# EAGLE design icy-gecko (EAGLE 9.5.1)
COMPANY: RST; CREVISION: 1.0; DESIGNER: Rafael Silva; LICENSE: GNU General Public License v3.0; LINK: https://github.com/gimbas

## Sheet 1 of 4: MCU
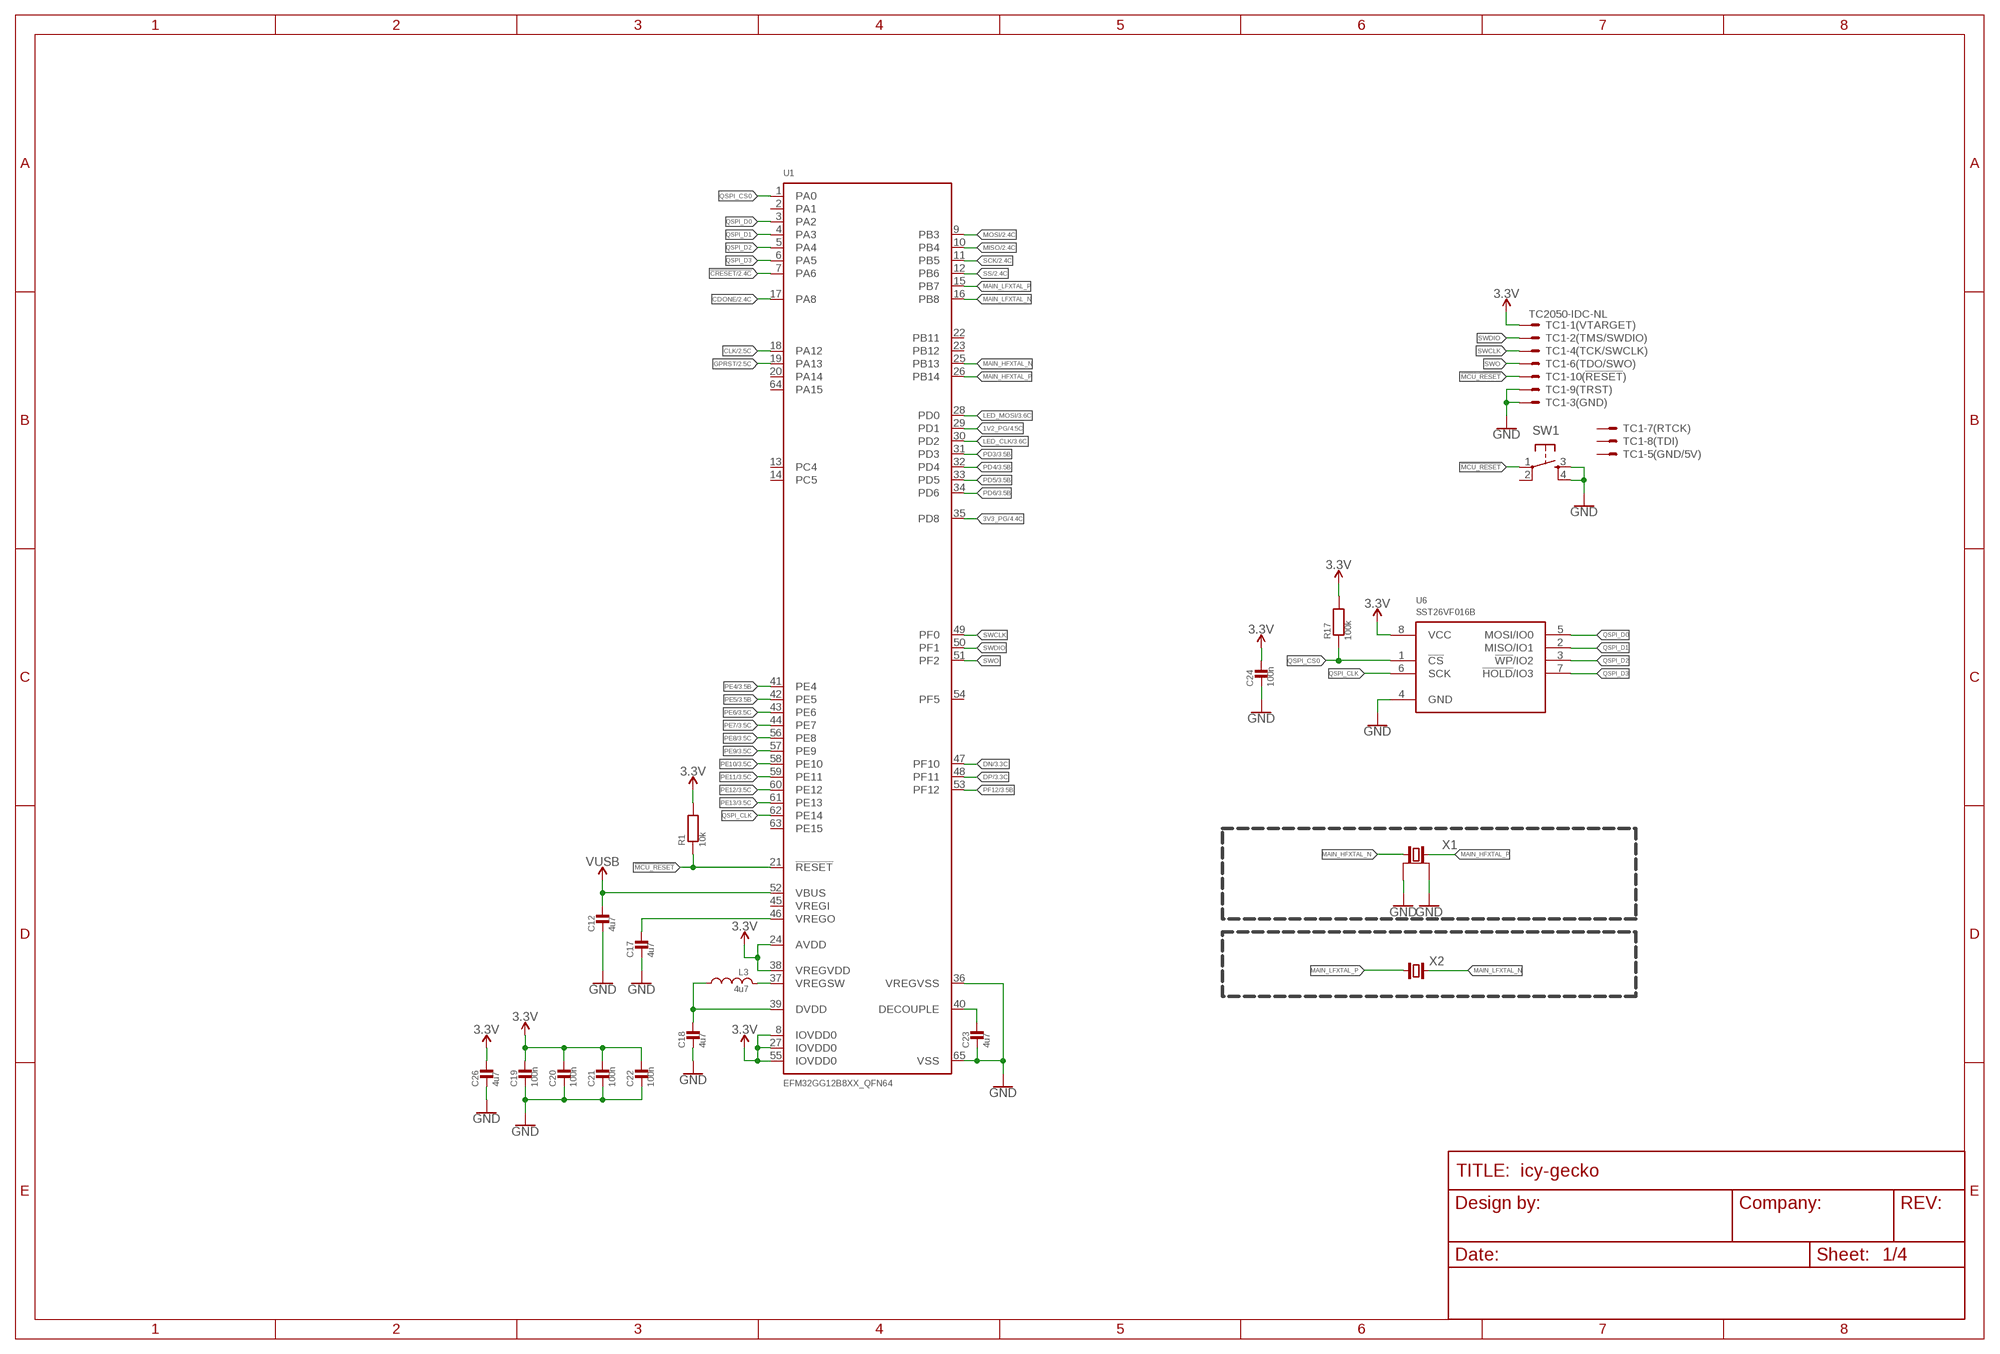
[diagram p0: schematic, sheet 1]

### Parts
C12  4u7  MLCC0603  [0603_WAVE]
C17  4u7  MLCC0603  [0603_WAVE]
C18  4u7  MLCC0603  [0603_WAVE]
C19  100n  MLCC0603  [0603_WAVE]
C20  100n  MLCC0603  [0603_WAVE]
C21  100n  MLCC0603  [0603_WAVE]
C22  100n  MLCC0603  [0603_WAVE]
C23  4u7  MLCC0603  [0603_WAVE]
C24  100n  MLCC0603  [0603_WAVE]
C26  4u7  MLCC0603  [0603_WAVE]
L3  4u7  INDUCTOR_NC_0806  [_0806]
R1  10k  RESISTOR0603  [0603_WAVE]
R17  100k  RESISTOR0603  [0603_WAVE]
SW1  PUSH_BUTTON  [PUSH_BUTTON]
TC1  TC2050-IDC-NL  [TC2050-IDC-NL]
U1  EFM32GG12B8XX_QFN64  [QFN64]
U6  SST26VF016B  [WSOIC8]
X1  CRYSTAL_4P  [4-SMD-3225]
X2  CRYSTAL2-SMD-3215  [2-SMD-3215]

### Nets
1V2_PG: U1.29(PD1) ; also sheet 4
3.3V: C19.P$1 C20.P$1 C21.P$1 C22.P$1 C24.P$1 C26.P$1 R1.P$2 R17.P$2 TC1.1 U1.8(IOVDD0) U1.24(AVDD) U1.27(IOVDD0) U1.38(VREGVDD) U1.55(IOVDD0) U6.8(VCC) ; also sheet 2,3,4
3V3_PG: U1.35(PD8) ; also sheet 4
!CRESET: U1.7(PA6) ; also sheet 2
!MCU_RESET: R1.P$1 SW1.1 TC1.10 U1.21(!RESET)
CDONE: U1.17(PA8) ; also sheet 2
CLK: U1.18(PA12) ; also sheet 2
DN: U1.47(PF10) ; also sheet 3
DP: U1.48(PF11) ; also sheet 3
GND: C12.P$2 C17.P$2 C18.P$2 C19.P$2 C20.P$2 C21.P$2 C22.P$2 C23.P$2 C24.P$2 C26.P$2 SW1.3 SW1.4 TC1.3 TC1.9 U1.36(VREGVSS) U1.65(VSS) U6.4(GND) X1.2(GND) X1.4(GND) ; also sheet 2,3,4
GPRST: U1.19(PA13) ; also sheet 2
LED_CLK: U1.30(PD2) ; also sheet 3
LED_MOSI: U1.28(PD0) ; also sheet 3
MAIN_HFXTAL_N: U1.25(PB13) X1.1
MAIN_HFXTAL_P: U1.26(PB14) X1.3
MAIN_LFXTAL_N: U1.16(PB8) X2.2
MAIN_LFXTAL_P: U1.15(PB7) X2.1
MISO: U1.10(PB4) ; also sheet 2
MOSI: U1.9(PB3) ; also sheet 2
N$39: C17.P$1 U1.46(VREGO)
N$43: L3.1 U1.37(VREGSW)
N$45: C23.P$1 U1.40(DECOUPLE)
N$48: C18.P$1 L3.2 U1.39(DVDD)
PD3: U1.31(PD3) ; also sheet 3
PD4: U1.32(PD4) ; also sheet 3
PD5: U1.33(PD5) ; also sheet 3
PD6: U1.34(PD6) ; also sheet 3
PE4: U1.41(PE4) ; also sheet 3
PE5: U1.42(PE5) ; also sheet 3
PE6: U1.43(PE6) ; also sheet 3
PE7: U1.44(PE7) ; also sheet 3
PE8: U1.56(PE8) ; also sheet 3
PE9: U1.57(PE9) ; also sheet 3
PE10: U1.58(PE10) ; also sheet 3
PE11: U1.59(PE11) ; also sheet 3
PE12: U1.60(PE12) ; also sheet 3
PE13: U1.61(PE13) ; also sheet 3
PF12: U1.53(PF12) ; also sheet 3
QSPI_CLK: U1.62(PE14) U6.6(SCK)
QSPI_CS0: R17.P$1 U1.1(PA0) U6.1(!CS!)
QSPI_D0: U1.3(PA2) U6.5(MOSI/IO0)
QSPI_D1: U1.4(PA3) U6.2(MISO/IO1)
QSPI_D2: U1.5(PA4) U6.3(!WP!/IO2)
QSPI_D3: U1.6(PA5) U6.7(!HOLD!/IO3)
SCK: U1.11(PB5) ; also sheet 2
SS: U1.12(PB6) ; also sheet 2
SWCLK: TC1.4 U1.49(PF0)
SWDIO: TC1.2 U1.50(PF1)
SWO: TC1.6 U1.51(PF2)
VUSB: C12.P$1 U1.52(VBUS) ; also sheet 3,4
Unconnected: SW1.2 TC1.5 TC1.7 TC1.8 U1.2(PA1) U1.13(PC4) U1.14(PC5) U1.20(PA14) U1.22(PB11) U1.23(PB12) U1.45(VREGI) U1.54(PF5) U1.63(PE15) U1.64(PA15)

## Sheet 2 of 4: FPGA
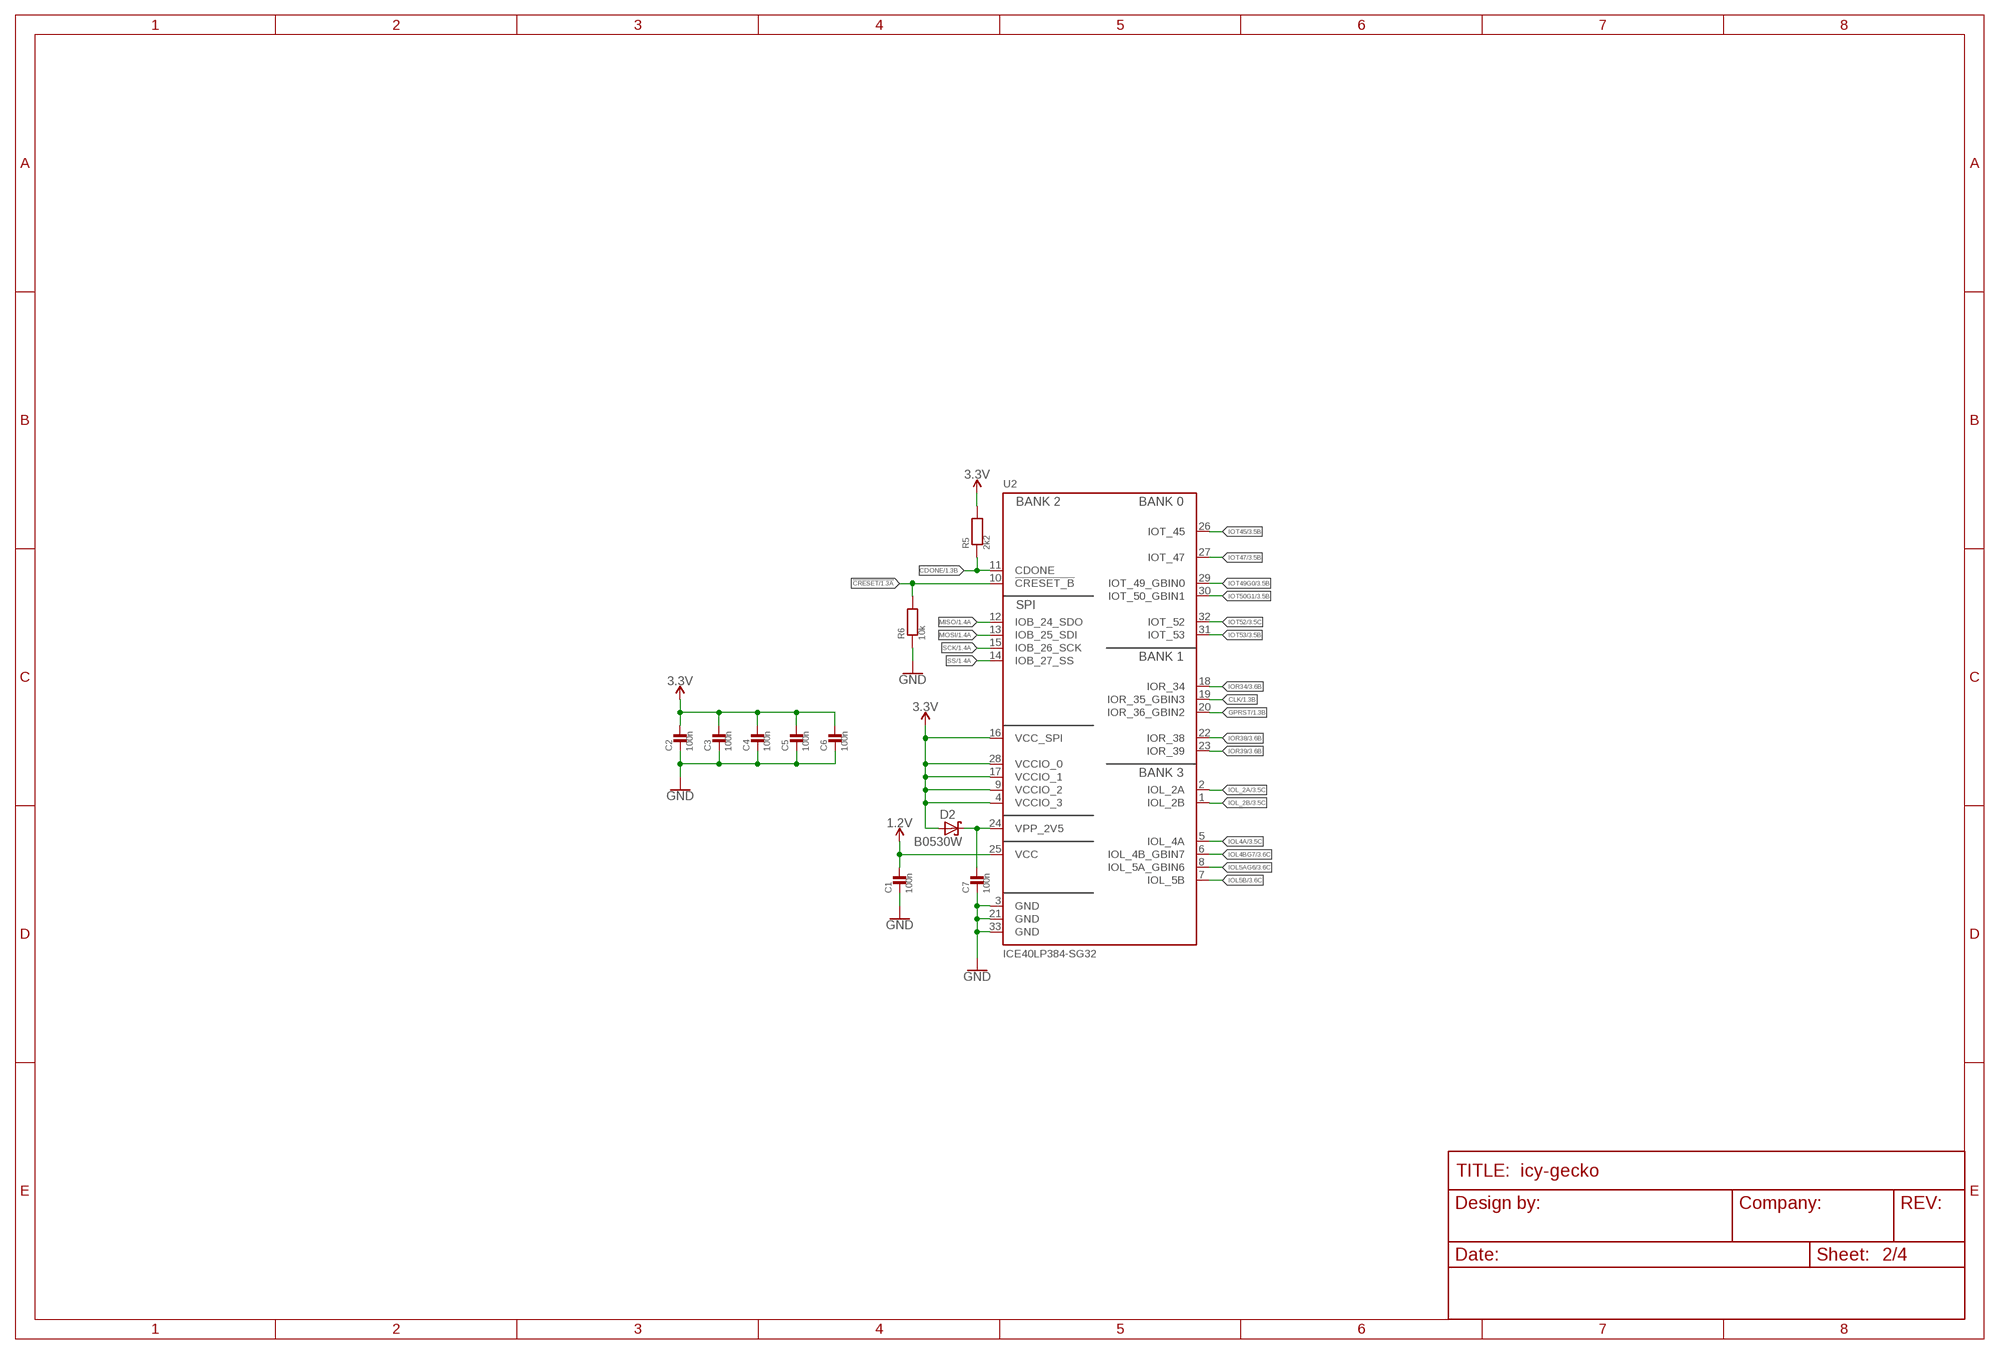
[diagram p1: schematic, sheet 2]

### Parts
C1  100n  MLCC0603  [0603_WAVE]
C2  100n  MLCC0603  [0603_WAVE]
C3  100n  MLCC0603  [0603_WAVE]
C4  100n  MLCC0603  [0603_WAVE]
C5  100n  MLCC0603  [0603_WAVE]
C6  100n  MLCC0603  [0603_WAVE]
C7  100n  MLCC0603  [0603_WAVE]
D2  B0530W  [SOD-123]
R5  2k2  RESISTOR0603  [0603_WAVE]
R6  10k  RESISTOR0603  [0603_WAVE]
U2  ICE40LP384-SG32  [QFN32]

### Nets
1.2V: C1.P$1 U2.25(VCC) ; also sheet 3,4
3.3V: C2.P$1 C3.P$1 C4.P$1 C5.P$1 C6.P$1 D2.A R5.P$2 U2.4(VCCIO_3) U2.9(VCCIO_2) U2.16(VCC_SPI) U2.17(VCCIO_1) U2.28(VCCIO_0) ; also sheet 1,3,4
!CRESET: R6.P$2 U2.10(!CRESET_B) ; also sheet 1
CDONE: R5.P$1 U2.11(CDONE) ; also sheet 1
CLK: U2.19(IOR_35_GBIN3) ; also sheet 1
GND: C1.P$2 C2.P$2 C3.P$2 C4.P$2 C5.P$2 C6.P$2 C7.P$2 R6.P$1 U2.3(GND) U2.21(GND) U2.33(GND) ; also sheet 1,3,4
GPRST: U2.20(IOR_36_GBIN2) ; also sheet 1
IOL4A: U2.5(IOL_4A) ; also sheet 3
IOL4BG7: U2.6(IOL_4B_GBIN7) ; also sheet 3
IOL5AG6: U2.8(IOL_5A_GBIN6) ; also sheet 3
IOL5B: U2.7(IOL_5B) ; also sheet 3
IOL_2A: U2.2(IOL_2A) ; also sheet 3
IOL_2B: U2.1(IOL_2B) ; also sheet 3
IOR34: U2.18(IOR_34) ; also sheet 3
IOR38: U2.22(IOR_38) ; also sheet 3
IOR39: U2.23(IOR_39) ; also sheet 3
IOT45: U2.26(IOT_45) ; also sheet 3
IOT47: U2.27(IOT_47) ; also sheet 3
IOT49G0: U2.29(IOT_49_GBIN0) ; also sheet 3
IOT50G1: U2.30(IOT_50_GBIN1) ; also sheet 3
IOT52: U2.32(IOT_52) ; also sheet 3
IOT53: U2.31(IOT_53) ; also sheet 3
MISO: U2.12(IOB_24_SDO) ; also sheet 1
MOSI: U2.13(IOB_25_SDI) ; also sheet 1
N$1: C7.P$1 D2.C U2.24(VPP_2V5)
SCK: U2.15(IOB_26_SCK) ; also sheet 1
SS: U2.14(IOB_27_SS) ; also sheet 1

## Sheet 3 of 4: IO
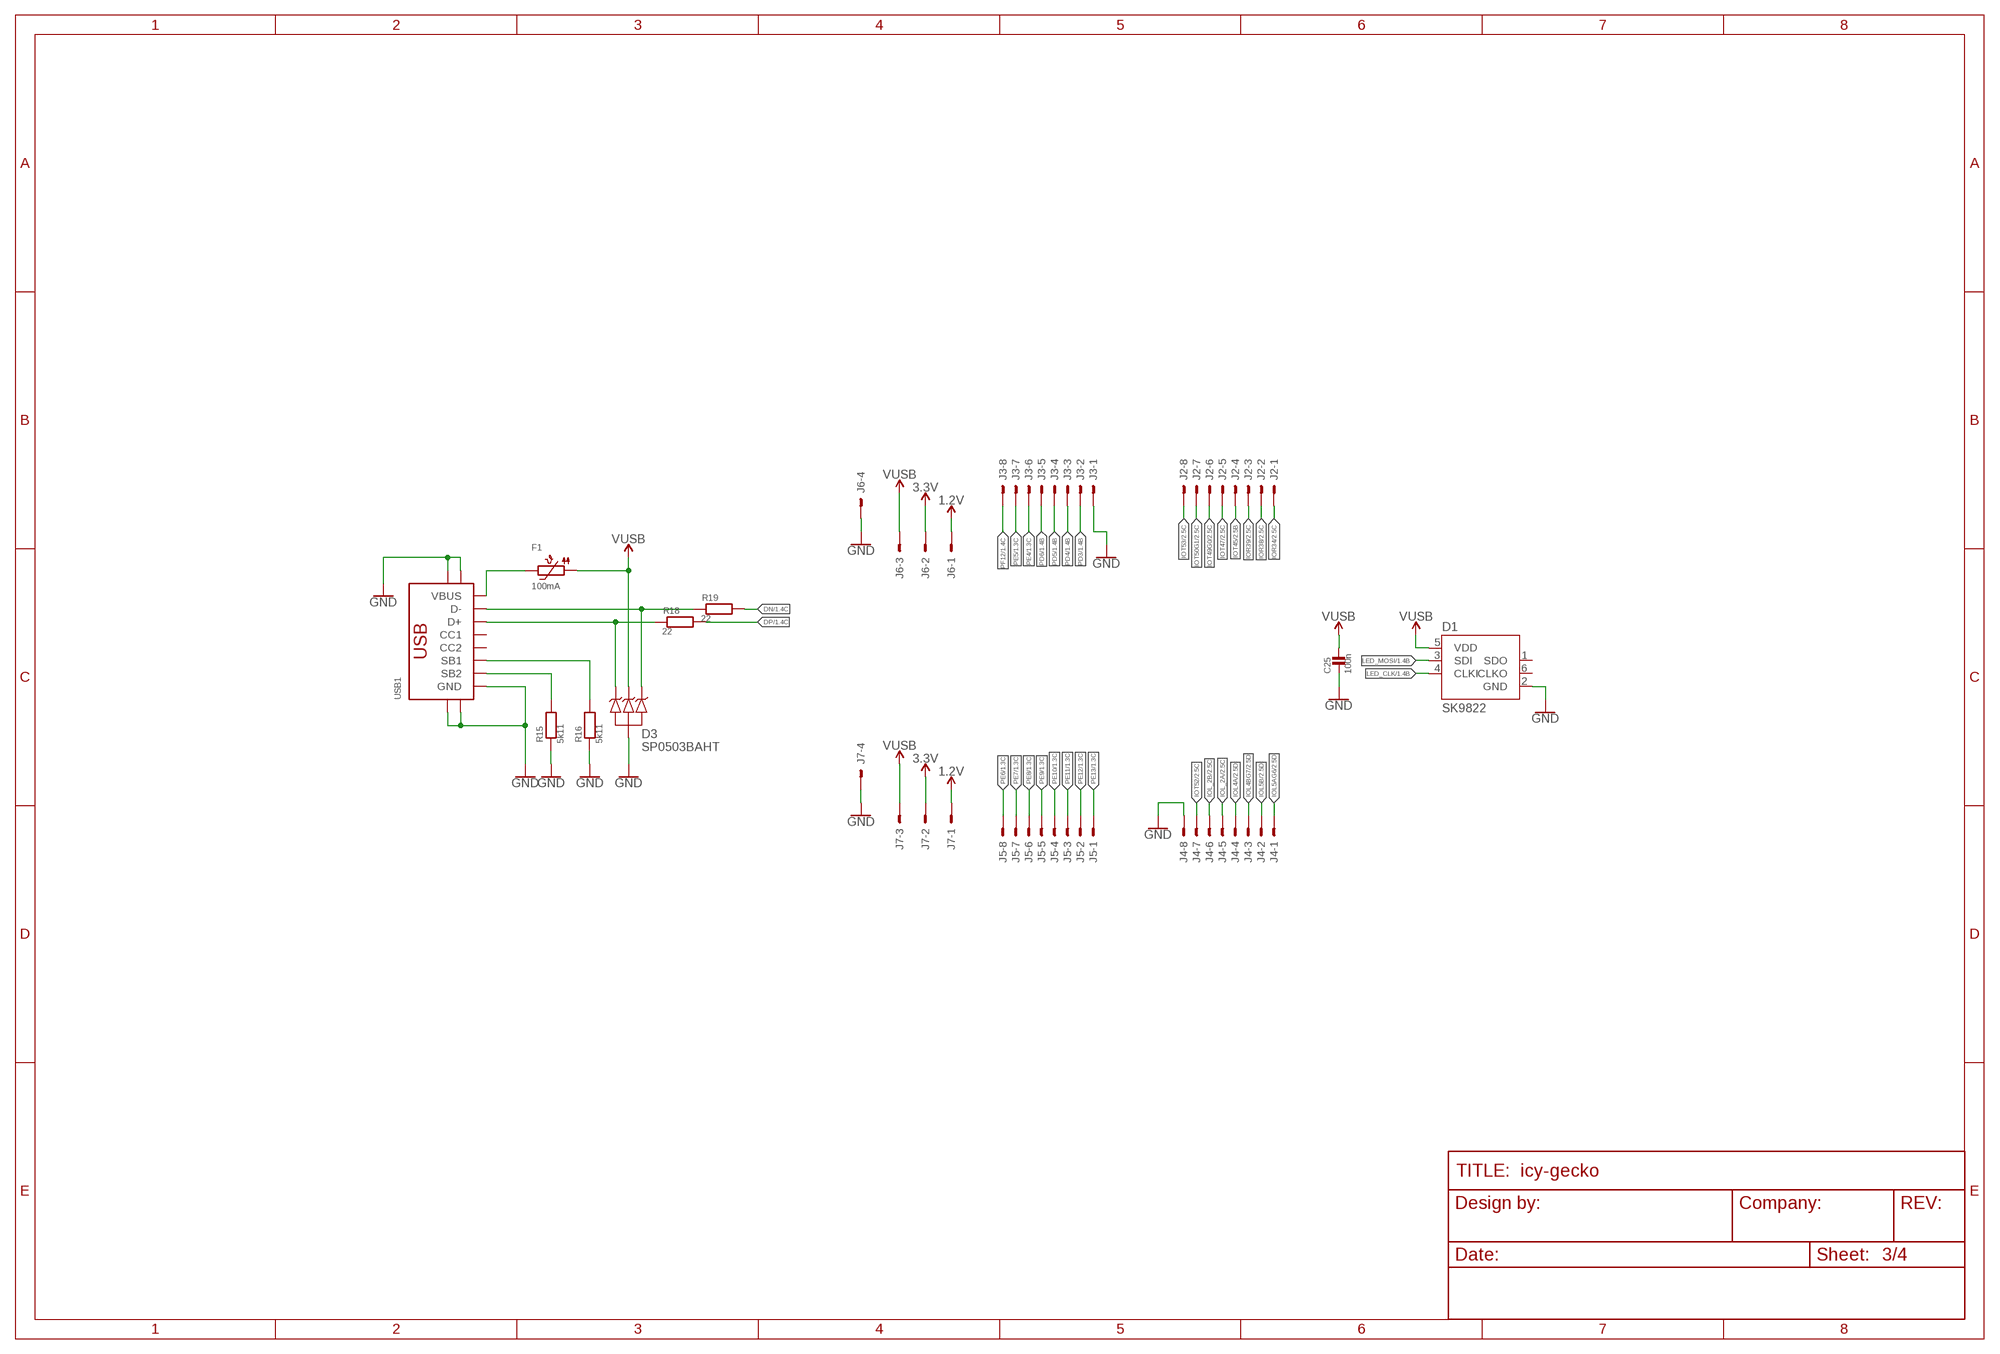
[diagram p2: schematic, sheet 3]

### Parts
C25  100n  MLCC0603  [0603_WAVE]
D1  SK9822  [2020]
D3  SP0503BAHT  [SOT143]
F1  100mA  PTC0805  [0805]
J2  8  [1X8_2.54]
J3  8  [1X8_2.54]
J4  8  [1X8_2.54]
J5  8  [1X8_2.54]
J6  4  [1X4_2.54]
J7  4  [1X4_2.54]
R15  5k11  RESISTOR0603  [0603_WAVE]
R16  5k11  RESISTOR0603  [0603_WAVE]
R18  22  RESISTOR0603  [0603_WAVE]
R19  22  RESISTOR0603  [0603_WAVE]
USB1  USB-C-16P-SMD-FLAT-SIDE-TYPE-2  [USB-C-16P-SMD-FLAT-SIDE-TYPE-2]

### Nets
1.2V: J6.1 J7.1 ; also sheet 2,4
3.3V: J6.2 J7.2 ; also sheet 1,2,4
DN: R19.P$2 ; also sheet 1
DP: R18.P$2 ; also sheet 1
GND: C25.P$2 D1.2(GND) D3.1 J3.1 J4.8 J6.4 J7.4 R15.P$1 R16.P$1 USB1.A1/B12(GND) USB1.B1/A12(GND) USB1.SHIELD@0(SHIELD) USB1.SHIELD@1(SHIELD) USB1.SHIELD@2(SHIELD) USB1.SHIELD@3(SHIELD) ; also sheet 1,2,4
IOL4A: J4.4 ; also sheet 2
IOL4BG7: J4.3 ; also sheet 2
IOL5AG6: J4.1 ; also sheet 2
IOL5B: J4.2 ; also sheet 2
IOL_2A: J4.5 ; also sheet 2
IOL_2B: J4.6 ; also sheet 2
IOR34: J2.1 ; also sheet 2
IOR38: J2.2 ; also sheet 2
IOR39: J2.3 ; also sheet 2
IOT45: J2.4 ; also sheet 2
IOT47: J2.5 ; also sheet 2
IOT49G0: J2.6 ; also sheet 2
IOT50G1: J2.7 ; also sheet 2
IOT52: J4.7 ; also sheet 2
IOT53: J2.8 ; also sheet 2
LED_CLK: D1.4(CLKI) ; also sheet 1
LED_MOSI: D1.3(SDI) ; also sheet 1
N$40: F1.2 USB1.A4/B9(VBUS) USB1.B4/A9(VBUS)
N$41: R15.P$2 USB1.B8(SB2)
N$42: R16.P$2 USB1.A8(SB1)
PD3: J3.2 ; also sheet 1
PD4: J3.3 ; also sheet 1
PD5: J3.4 ; also sheet 1
PD6: J3.5 ; also sheet 1
PE4: J3.6 ; also sheet 1
PE5: J3.7 ; also sheet 1
PE6: J5.8 ; also sheet 1
PE7: J5.7 ; also sheet 1
PE8: J5.6 ; also sheet 1
PE9: J5.5 ; also sheet 1
PE10: J5.4 ; also sheet 1
PE11: J5.3 ; also sheet 1
PE12: J5.2 ; also sheet 1
PE13: J5.1 ; also sheet 1
PF12: J3.8 ; also sheet 1
USBDN: D3.4 R19.P$1 USB1.A7(D-) USB1.B7(D-)
USBDP: D3.2 R18.P$1 USB1.A6(D+) USB1.B6(D+)
VUSB: C25.P$1 D1.5(VDD) D3.3 F1.1 J6.3 J7.3 ; also sheet 1,4
Unconnected: D1.1(SDO) D1.6(CLKO) USB1.A5(CC1) USB1.B5(CC2)

## Sheet 4 of 4: POWER
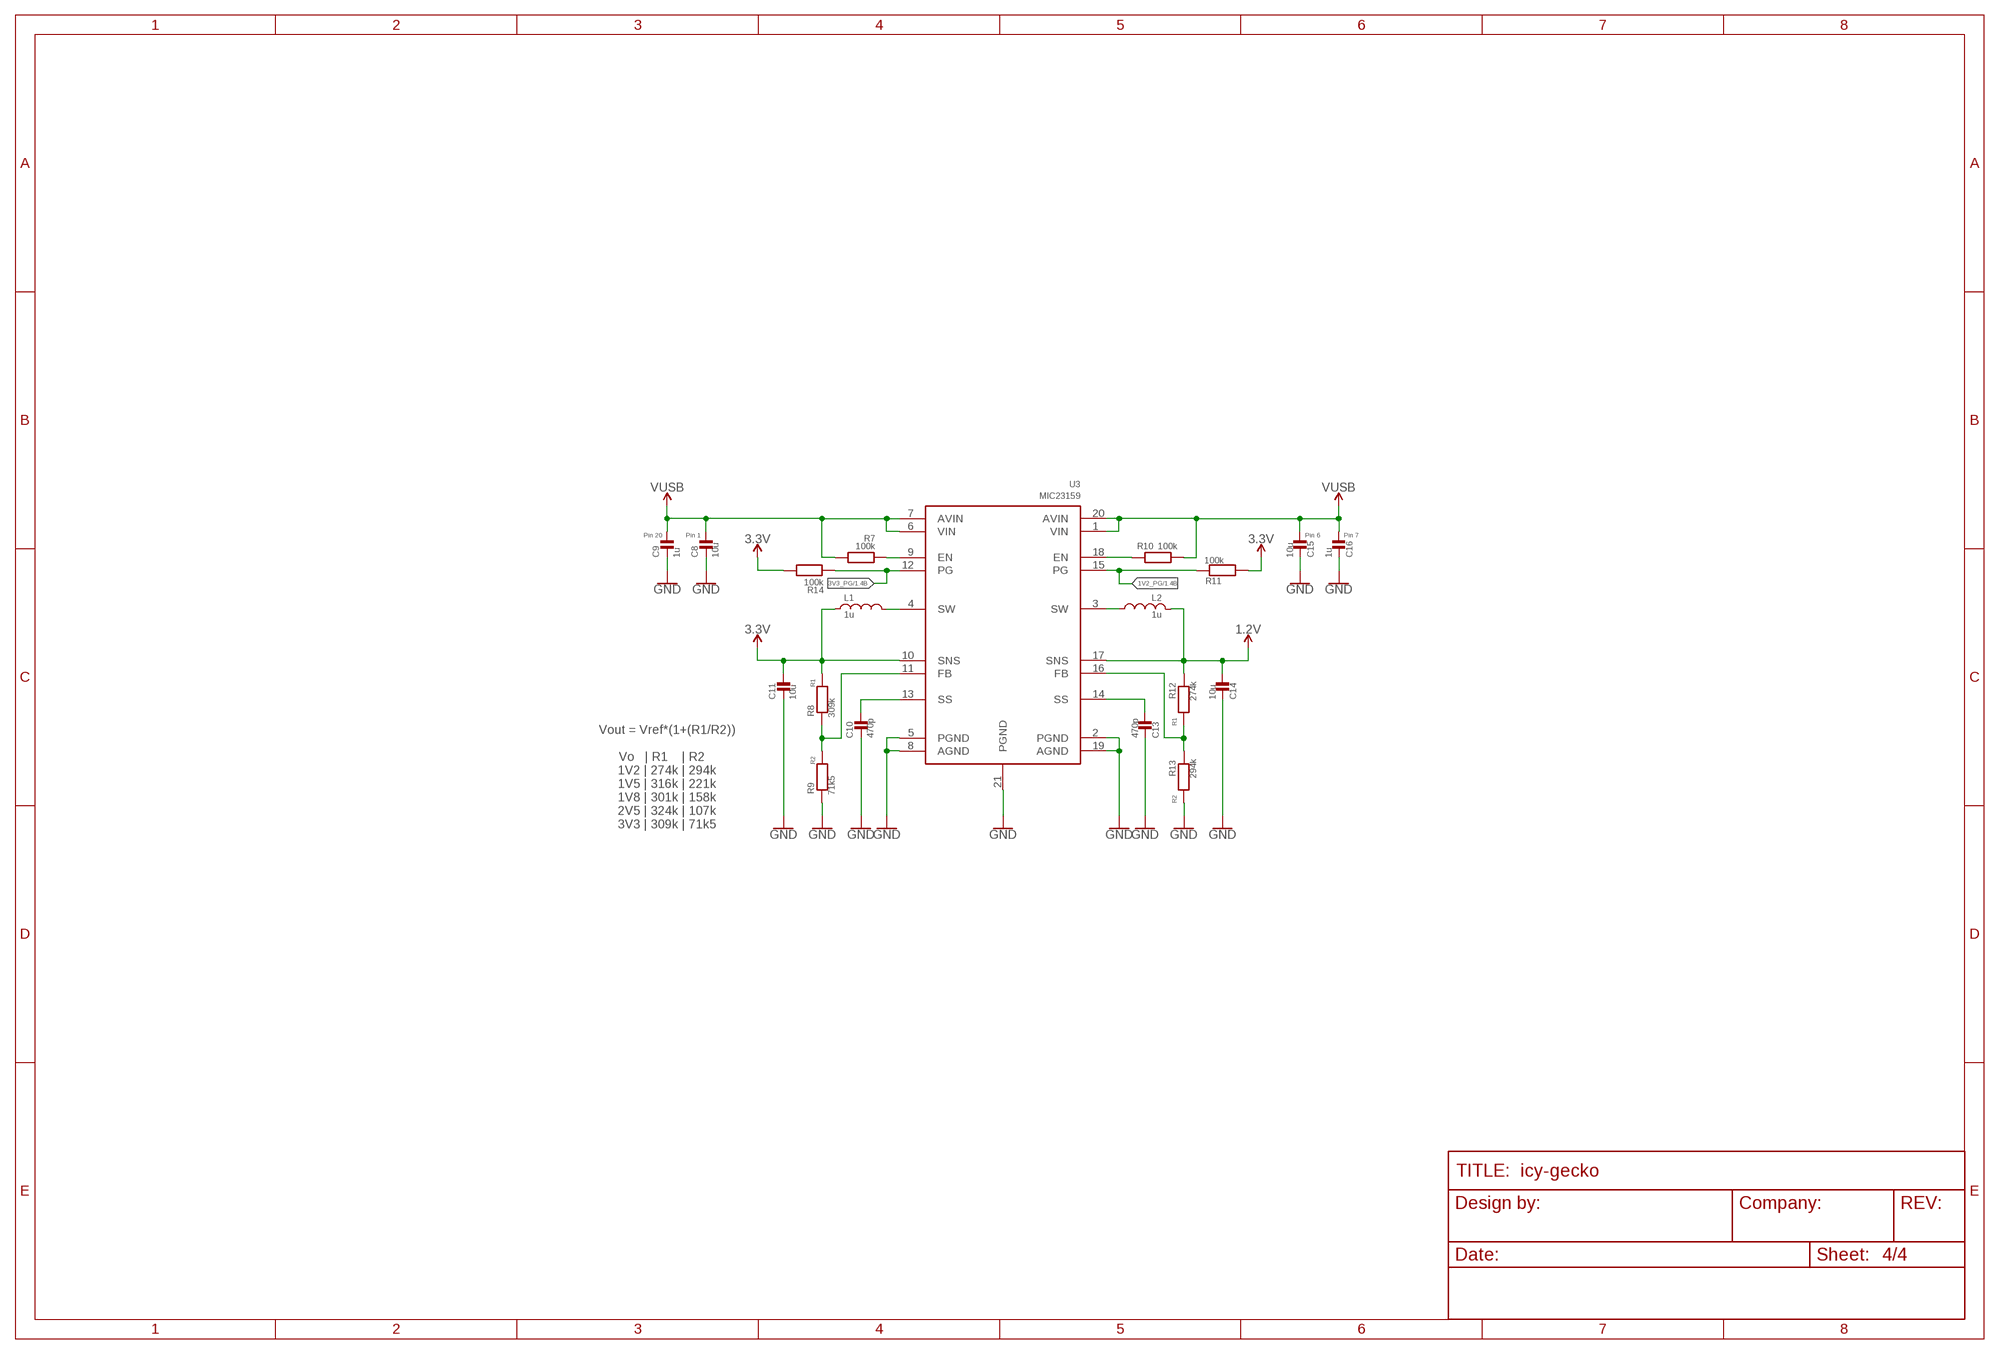
[diagram p3: schematic, sheet 4]

### Parts
C8  10u  MLCC0603  [0603_WAVE]
C9  1u  MLCC0603  [0603_WAVE]
C10  470p  MLCC0603  [0603_WAVE]
C11  10u  MLCC0603  [0603_WAVE]
C13  470p  MLCC0603  [0603_WAVE]
C14  10u  MLCC0603  [0603_WAVE]
C15  10u  MLCC0603  [0603_WAVE]
C16  1u  MLCC0603  [0603_WAVE]
L1  1u  INDUCTOR_NC_0806  [_0806]
L2  1u  INDUCTOR_NC_0806  [_0806]
R7  100k  RESISTOR0603  [0603_WAVE]
R8  309k  RESISTOR0603  [0603_WAVE]
R9  71k5  RESISTOR0603  [0603_WAVE]
R10  100k  RESISTOR0603  [0603_WAVE]
R11  100k  RESISTOR0603  [0603_WAVE]
R12  274k  RESISTOR0603  [0603_WAVE]
R13  294k  RESISTOR0603  [0603_WAVE]
R14  100k  RESISTOR0603  [0603_WAVE]
U3  MIC23159  [VQFN20]

### Nets
1.2V: C14.P$1 L2.1 R12.P$1 U3.17(SNS) ; also sheet 2,3
1V2_PG: R11.P$1 U3.15(PG) ; also sheet 1
3.3V: C11.P$1 L1.1 R8.P$2 R11.P$2 R14.P$2 U3.10(SNS) ; also sheet 1,2,3
3V3_PG: R14.P$1 U3.12(PG) ; also sheet 1
GND: C8.P$2 C9.P$2 C10.P$2 C11.P$2 C13.P$2 C14.P$2 C15.P$2 C16.P$2 R9.P$1 R13.P$2 U3.2(PGND) U3.5(PGND) U3.8(AGND) U3.19(AGND) U3.21(PGND) ; also sheet 1,2,3
MPU_PWR: R10.P$1 U3.18(EN)
N$32: R7.P$1 U3.9(EN)
N$33: L1.2 U3.4(SW)
N$34: C10.P$1 U3.13(SS)
N$35: R8.P$1 R9.P$2 U3.11(FB)
N$36: L2.2 U3.3(SW)
N$37: C13.P$1 U3.14(SS)
N$38: R12.P$2 R13.P$1 U3.16(FB)
VUSB: C8.P$1 C9.P$1 C15.P$1 C16.P$1 R7.P$2 R10.P$2 U3.1(VIN) U3.6(VIN) U3.7(AVIN) U3.20(AVIN) ; also sheet 1,3

### Notes on the sheet
- Pin 20 | Pin 1 | Pin 6 | Pin 7
- R1
- R1
- R2
- Vout = Vref*(1+(R1/R2))
  
   Vo   | R1    | R2    
  1V2 | 274k | 294k
  1V5 | 316k | 221k
  1V8 | 301k | 158k
  2V5 | 324k | 107k
  3V3 | 309k | 71k5
- R2

## Library data of the parts
C1-C26 = Passive Components > Capacitors > Multilayer Ceramic Capacitors MLCC:MLCC: KEMET’s X7R dielectric features a 125°C maximum operating temperature and is considered temperature stable. The Electronics Components, Assemblies and Materials Association (EIA) characterizes X7R dielectric as a Class II material. Components of this classification are fixed, ceramic dielectric capacitors suited for bypass and decoupling applications or for frequency discriminating circuits where Q and stability of capacitance characteristics are not critical. X7R exhibits a predictable change in capacitance with respect to time and voltage, boasting a minimal change in capacitance with reference to ambient temperature. Capacitance change is limited to ±15% from −55°C to +125°C.
D1 = Opto-electronics > LED Emitters:SK9822
D2 = Semiconductors > Discrete Semiconductors > Diodes & Rectifiers > Schottky Diodes & Rectifiers:B0530W
D3 = Circuit Protection > ESD Suppressors \ TVS Diodes:SP0503BAHT
F1 = Circuit Protection > Resettable Fuses - PPTC:PTC
J2-J5 = Connectors > Header:8
J6 J7 = Connectors > Header:4
L1-L3 = Passive Components > Inductors, Chokes & Coils:INDUCTOR_NC
R1 R5-R19 = Passive Components > Resistors > Chip Resistors:RESISTOR: Resistors For new designs, use the packages preceded by an '_' character since they are more reliable: The following footprints should be used on most boards: _0402 - Standard footprint for regular board layouts _0603 - Standard footprint for regular board layouts _0805 - Standard footprint for regular board layouts _1206 - Standard footprint for regular board layouts For extremely tight-pitch boards where space is at a premium, the following 'micro-pitch' footprints can be used (smaller pads, no silkscreen outline, etc.): _0402MP - Micro-pitch footprint for very dense/compact boards _0603MP - Micro-pitch footprint for very dense/compact boards _0805MP - Micro-pitch footprint for very dense/compact boards _1206MP - Micro-pitch footprint for very dense/compact boards
SW1 = Eletromechanical > Switches > Tactile Switches:PUSH_BUTTON
TC1 = Connectors > Other:TC2050-IDC
U1 = Semiconductors > Embedded Processors & Controllers > Microcontrollers - MCU:EFM32GG12B8XX_QFN64
U2 = Semiconductors > Embedded Processors & Controllers > FPGA - Field Programmable Gate Array:ICE40LP384-SG32
U3 = Power > Switching Controllers:MIC23159
U6 = Microchip:SST26VF016B
USB1 = Connectors > USB:USB-C-16P-SMD-FLAT-SIDE
X1 = Passive Components > Frequency Control & Timing Devices > Crystals:CRYSTAL_4P
X2 = Passive Components > Frequency Control & Timing Devices > Crystals:CRYSTAL

## Board
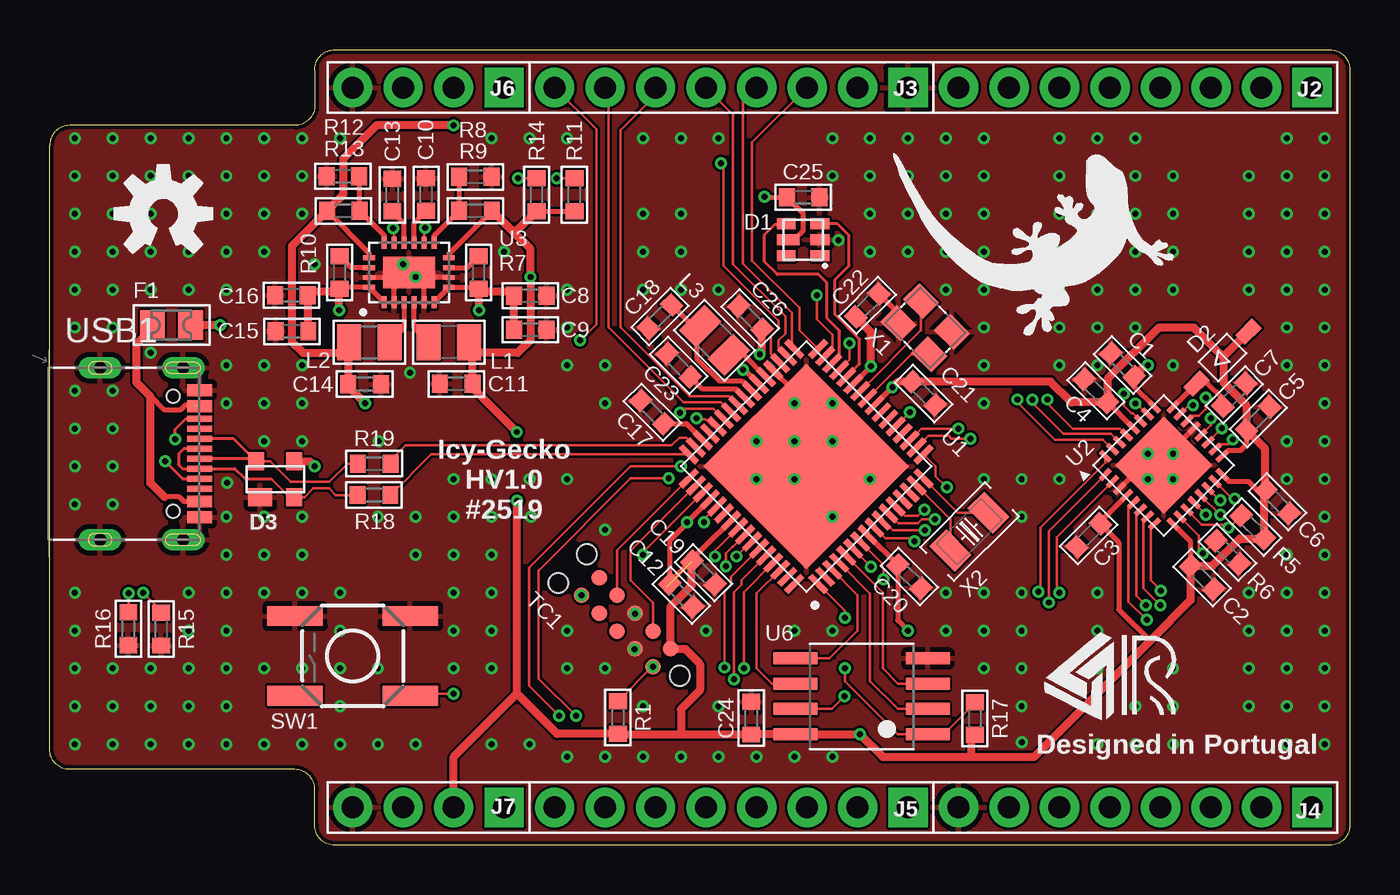
[diagram p4: board, top side]
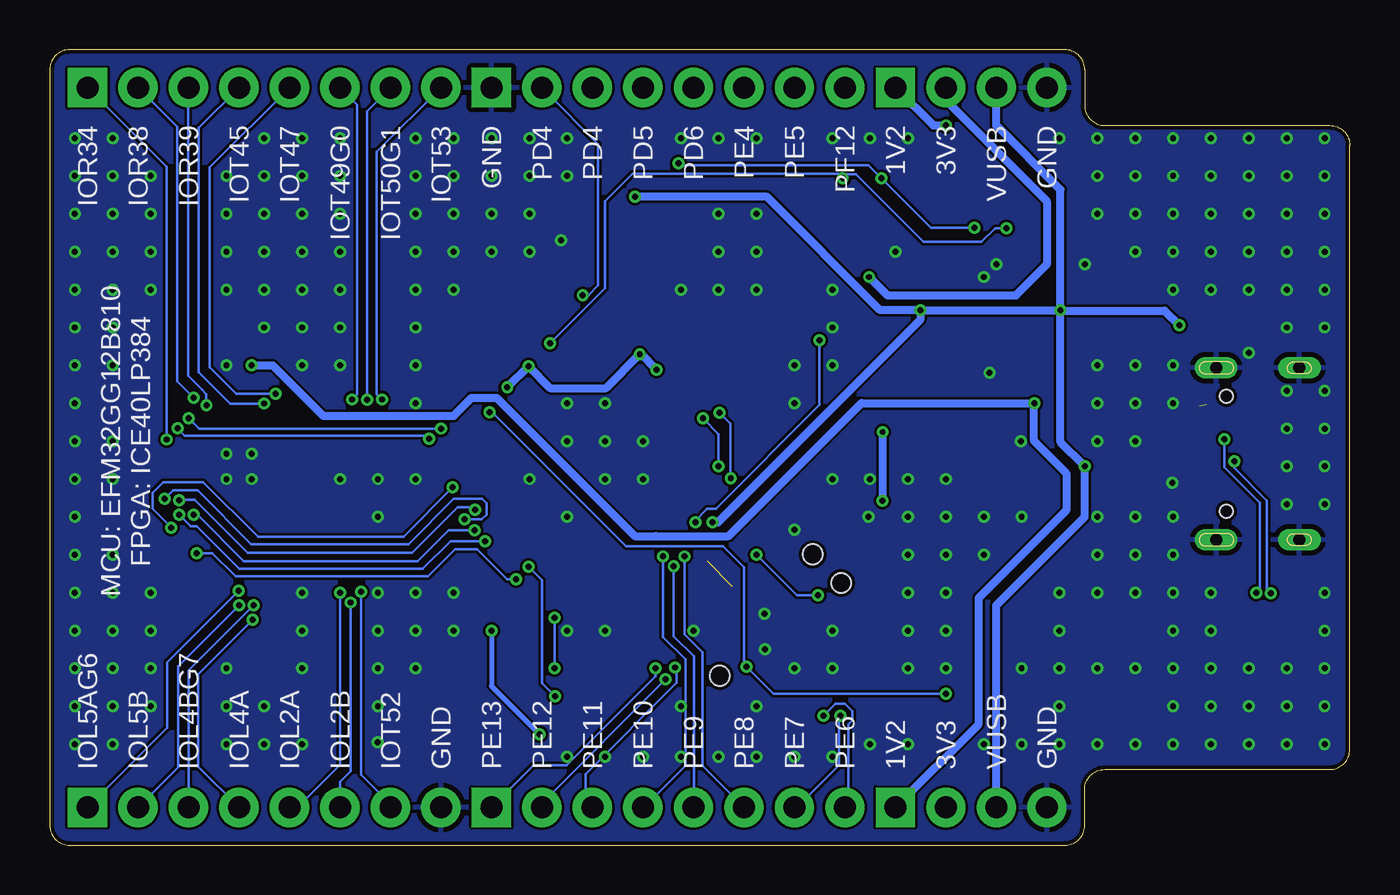
[diagram p5: board, bottom side, seen from below]

Size 65.41 x 40.01 mm. Coordinates in mm from the lower left corner, seen from the top.
Outline: 12.34,36.2 1,36.2 arc90 0,35.2 0,4.81 arc90 1,3.81 12.34,3.81 arc-90 13.34,2.81 13.34,1 arc90 14.34,0 64.41,0 arc90 65.41,1 65.41,39.01 arc90 64.41,40.01 14.34,40.01 arc90 13.34,39.01 13.34,37.2 arc-90 12.34,36.2
Copper layers (1*16): Top 0.035mm / dielectric 1.2mm / Bottom 0.035mm
Design rules "jlcpcb-2l-dr": minimum track width 5mil, minimum drill 0.3mm, track to track 5mil, track to pad 5mil, pad to pad 5mil, via to via 5mil, smd to smd 5mil, copper to edge 0.2mm, drill to drill 5mil, minimum pad ring 3mil, minimum via ring 3mil, stop-mask expansion 4mil, vias tented up to drill 0.5mm, thermal gap 10mil

### Footprints (pad centres in the part's own frame; a part is rotated, then mirrored left to right if it is on the bottom)
0603_WAVE = smd 0.8 x 0.9: P$1 -0.823,0; P$2 0.823,0
2020 = smd 0.95 x 0.55: 1 -0.85,0.8; 2 -0.85,0; 3 -0.85,-0.8; 4 0.85,-0.8; 6 0.85,0.8 | smd 1.15 x 0.55: 5 0.75,0
SOD-123 = smd 1.2 x 0.7: A 1.85,0; C -1.85,0
SOT143 = smd 1.2 x 0.9: 1 -0.711,-0.889 | smd 0.8 x 0.9: 2 0.989,-0.889; 3 0.989,0.911; 4 -0.911,0.911
0805 = smd 1.245 x 1.473: 1 -0.965,0; 2 0.965,0
1X8_2.54 = drill 1.1 square: 1 -2.54,0 | drill 1.1: 2 0,0; 3 2.54,0; 4 5.08,0; 5 7.62,0; 6 10.16,0; 7 12.7,0; 8 15.24,0
1X4_2.54 = drill 1.1 square: 1 -2.54,0 | drill 1.1: 2 0,0; 3 2.54,0; 4 5.08,0
_0806 = smd 1.2 x 1.8: 1 -1.016,0; 2 1.016,0
PUSH_BUTTON = smd 2.8 x 1: 1 -2.9,2; 2 2.9,2; 3 -2.9,-2; 4 2.9,-2
TC2050-IDC-NL = smd 0.787 x 0.787: 1 -2.54,-0.635; 2 -1.27,-0.635; 3 0,-0.635; 4 1.27,-0.635; 5 2.54,-0.635; 6 2.54,0.635; 7 1.27,0.635; 8 0,0.635; 9 -1.27,0.635; 10 -2.54,0.635 | hole 0.991: -3.81,0; 3.81,1.016; 3.81,-1.016
QFN64 = smd 1.15 x 0.3: 1 -4.6,3.75; 2 -4.6,3.25; 3 -4.6,2.75; 4 -4.6,2.25; 5 -4.6,1.75; 6 -4.6,1.25; 7 -4.6,0.75; 8 -4.6,0.25; 9 -4.6,-0.25; 10 -4.6,-0.75; 11 -4.6,-1.25; 12 -4.6,-1.75; 13 -4.6,-2.25; 14 -4.6,-2.75; 15 -4.6,-3.25; 16 -4.6,-3.75; 33 4.6,-3.75; 34 4.6,-3.25; 35 4.6,-2.75; 36 4.6,-2.25; 37 4.6,-1.75; 38 4.6,-1.25; 39 4.6,-0.75; 40 4.6,-0.25; 41 4.6,0.25; 42 4.6,0.75; 43 4.6,1.25; 44 4.6,1.75; 45 4.6,2.25; 46 4.6,2.75; 47 4.6,3.25; 48 4.6,3.75 | smd 0.3 x 1.15: 17 -3.75,-4.6; 18 -3.25,-4.6; 19 -2.75,-4.6; 20 -2.25,-4.6; 21 -1.75,-4.6; 22 -1.25,-4.6; 23 -0.75,-4.6; 24 -0.25,-4.6; 25 0.25,-4.6; 26 0.75,-4.6; 27 1.25,-4.6; 28 1.75,-4.6; 29 2.25,-4.6; 30 2.75,-4.6; 31 3.25,-4.6; 32 3.75,-4.6; 49 3.75,4.6; 50 3.25,4.6; 51 2.75,4.6; 52 2.25,4.6; 53 1.75,4.6; 54 1.25,4.6; 55 0.75,4.6; 56 0.25,4.6; 57 -0.25,4.6; 58 -0.75,4.6; 59 -1.25,4.6; 60 -1.75,4.6; 61 -2.25,4.6; 62 -2.75,4.6; 63 -3.25,4.6; 64 -3.75,4.6 | smd 7.3 x 7.3: 65 0,0
QFN32 = smd 0.7 x 0.25: 1 -2.4,1.75; 2 -2.4,1.25; 3 -2.4,0.75; 4 -2.4,0.25; 5 -2.4,-0.25; 6 -2.4,-0.75; 7 -2.4,-1.25; 8 -2.4,-1.75; 17 2.4,-1.75; 18 2.4,-1.25; 19 2.4,-0.75; 20 2.4,-0.25; 21 2.4,0.25; 22 2.4,0.75; 23 2.4,1.25; 24 2.4,1.75 | smd 0.25 x 0.7: 9 -1.75,-2.4; 10 -1.25,-2.4; 11 -0.75,-2.4; 12 -0.25,-2.4; 13 0.25,-2.4; 14 0.75,-2.4; 15 1.25,-2.4; 16 1.75,-2.4; 25 1.75,2.4; 26 1.25,2.4; 27 0.75,2.4; 28 0.25,2.4; 29 -0.25,2.4; 30 -0.75,2.4; 31 -1.25,2.4; 32 -1.75,2.4 | smd 3.45 x 3.45: 33 0,0
VQFN20 = smd 0.6 x 0.25: 1 -1.5,1.25; 2 -1.5,0.75; 3 -1.5,0.25; 4 -1.5,-0.25; 5 -1.5,-0.75; 6 -1.5,-1.25; 11 1.5,-1.25; 12 1.5,-0.75; 13 1.5,-0.25; 14 1.5,0.25; 15 1.5,0.75; 16 1.5,1.25 | smd 0.25 x 0.6: 7 -0.75,-2; 8 -0.25,-2; 9 0.25,-2; 10 0.75,-2; 17 0.75,2; 18 0.25,2; 19 -0.25,2; 20 -0.75,2 | smd 1.6 x 2.6: 21 0,0
WSOIC8 = smd 0.6 x 2.2: 1 -1.905,-3.33; 2 -0.635,-3.33; 3 0.635,-3.33; 4 1.905,-3.33; 5 1.905,3.33; 6 0.635,3.33; 7 -0.635,3.33; 8 -1.905,3.33
USB-C-16P-SMD-FLAT-SIDE-TYPE-2 = smd 1.25 x 0.6: A1/B12 5,3.2; A4/B9 5,2.4; B1/A12 5,-3.2; B4/A9 5,-2.4 | smd 1.25 x 0.3: A5 5,1.25; A6 5,0.25; A7 5,-0.25; A8 5,-1.25; B5 5,-1.75; B6 5,-0.75; B7 5,0.75; B8 5,1.75 | drill 0.6 pad 1 long: SHIELD@0 0,4.32; SHIELD@1 4.18,4.32; SHIELD@2 4.18,-4.32; SHIELD@3 0,-4.32 | hole 0.65: 3.68,2.89; 3.68,-2.89
4-SMD-3225 = smd 1.4 x 1.15: 1 -1.1,0.8; 2 1.1,0.8; 3 1.1,-0.8; 4 -1.1,-0.8
2-SMD-3215 = smd 1.2 x 1.8: 1 -1.35,0; 2 1.35,0

### Placement (x,y rotation side)
C1  53.97,24.15 135 top
C2  57.98,13.46 315 top
C3  52.27,15.58 225 top
C4  52.63,22.85 135 top
C5  60.8,21.46 45 top
C6  61.77,17.27 315 top
C7  59.59,22.65 45 top
C8  24.18,27.63 0 top
C9  24.18,25.92 0 top
C10  18.94,32.72 90 top
C11  20.45,23.2 180 top
C12  31.77,12.57 315 top
C13  17.24,32.7 90 top
C14  15.84,23.19 0 top
C15  12.19,25.84 180 top
C16  12.16,27.66 180 top
C17  30.31,21.78 135 top
C18  30.7,26.59 225 top
C19  32.9,13.7 315 top
C20  43.25,13.51 315 top
C21  43.97,22.72 315 top
C22  41.14,27.15 45 top
C23  31.64,24.14 135 top
C24  35.3,6.39 90 top
C25  37.91,32.59 0 top
C26  35.25,26.53 135 top
D1  37.91,30.45 180 top
D2  59,24.52 45 top
D3  11.3,18.39 0 top
F1  6.13,26.16 180 top
J2  60.96,38.1 180 top
J3  40.64,38.1 180 top
J4  60.96,1.91 180 top
J5  40.64,1.91 180 top
J6  20.32,38.1 180 top
J7  20.32,1.91 180 top
L1  20.08,25.3 180 top
L2  16.08,25.3 0 top
L3  33.45,25.39 135 top
R1  28.59,6.42 270 top
R5  60.52,16 315 top
R6  59.26,14.73 135 top
R7  21.58,28.8 270 top
R8  21.42,31.91 0 top
R9  21.41,33.61 180 top
R10  14.58,28.8 270 top
R11  26.39,32.71 270 top
R12  14.77,31.9 0 top
R13  14.75,33.64 180 top
R14  24.49,32.71 270 top
R15  5.61,10.87 90 top
R16  3.96,10.88 90 top
R17  46.54,6.37 270 top
R18  16.32,17.61 0 top
R19  16.32,19.19 0 top
SW1  15.24,9.53 180 top
TC1  29,11.21 135 top
U1  38.06,19.05 135 top
U2  56.05,19.1 45 top
U3  18.08,28.8 90 top
U6  40.84,7.49 90 top
U$1  [GECKO_POLY]  51.44,29.84 315 top
U$2  [OSHW-LOGO-M]  5.71,31.75 0 top
U$3  [RAFAEL_SILVA_5MM_ALT_3]  50.8,8.26 0 top
USB1  2.54,19.68 0 top
X1  44.05,26.03 135 top
X2  46.27,15.77 45 top

### Tracks (layer width: path | path; a pad name or v marks a point on that pad's centre or on a via)
1.2V  (via drill 0.3)
  Top 0.127: L2.1 15.02,25.25 15.02,24.77
  Top 0.254: U3.17 16.08,29.77 R12.P$1 | U2.25 54.55,23.07 C1.P$1 | 15.02,23.08 C14.P$1
  Top 0.406: C14.P$1 15.02,24.77 12.74,24.77 12.18,25.33 12.18,30.13 R12.P$1 14.77,32.72 14.77,34.53 16.43,36.2 v20.32,36.2 | C1.P$1 55.11,24.13 v55.24,24.13 | v15.88,22.23 15.02,23.08
  Bottom 0.406: v55.24,24.13 54.18,24.13 51.64,21.59 45.09,21.59 44.19,22.49 42.92,22.49 35.97,15.54 34.92,15.54 31.25,15.54 24.56,22.23 v15.88,22.23 | v15.88,22.23 | J7.1 18.67,6.09 18.67,12.44 14.23,16.88 14.23,18.68 15.88,20.33 v15.88,22.23 | J6.1 20.95,36.2 v20.32,36.2
1V2_PG  (via drill 0.3)
  Top 0.127: U3.15 17.34,30.95 17.28,31.01 v17.28,31.03 | U1.29 40.24,24.41 v40.24,25.25 | R11.P$1 v25.51,33.53
  Top 0.254: R11.P$1
  Bottom 0.127: v17.28,31.03 17.83,31.03 18.52,30.34 21.45,30.34 24.85,33.74 25.3,33.74 v25.51,33.53 25.73,33.76 36.09,33.76 37.47,32.38 37.47,28.02 v40.24,25.25
3.3V  (via drill 0.3)  (1 unrouted)
  Top 0.127: 34.96,23.92 v34.87,23.92 | v35.72,24.68 35.83,24.79 | 32.95,15 32.3,14.35 | 31.04,13.09 31.04,13.01 | 35.31,5.58 C24.P$1 | 28.61,5.57 R1.P$2 | 21.27,23.01 C11.P$1 | 21.2,24.77 21.2,25.19 L1.1 | 52.85,16.26 C3.P$1 | 61.11,17.77 C6.P$1 | 53.23,22.27 C4.P$1 | 59.05,24.55 | R17.P$2 46.35,5.36
  Top 0.254: v42.38,23.02 U1.24 | v41.32,24.08 U1.27 | U1.38 34.96,23.92 | U1.55 32.95,15 31.04,13.09 | C3.P$1 53.78,15.23 53.78,11.85 55.36,10.28 | U2.4 52.85,16.26 | U2.9 57.39,15.28 C2.P$1 | C6.P$1 60.75,17.85 60.32,18.28 59.34,18.28 U2.16 | U2.17 59.27,19.85 59.9,19.85 60.21,20.16 C5.P$1 | U2.28 53.23,22.27 | R8.P$2 20.08,29.75 U3.10 | U1.8 C20.P$1 42.67,11.31 v43.18,10.79 | R14.P$2 R11.P$2
  Top 0.406: v42.38,23.02 42.67,23.3 C21.P$1 43.4,23.31 50.35,23.31 51.39,22.27 C4.P$1 53.21,23.45 55.8,26.04 57.56,26.04 59.05,24.55 | 35.83,24.79 C26.P$1 | 35.31,5.58 U6.8 v40.77,5.58 41.91,4.45 46.35,4.45 | C24.P$1 31.75,5.57 | 31.75,5.57 28.61,5.57 | R1.P$2 25.52,5.6 23.5,7.61 | 23.5,7.61 23.5,7.62 20.32,4.45 J7.2 | v23.5,20.78 21.27,23.01 | 23.5,7.61 v23.5,17.32 | C11.P$1 21.27,24.77 | 31.75,5.57 31.75,6.83 32.71,7.79 32.71,9.12 31.96,9.87 TC1.1 31.24,12 32.3,13.06 32.3,14.35 | 46.35,4.45 49.53,4.45 55.36,10.28 57.39,12.31 C2.P$1 58.49,14.04 59.87,15.42 R5.P$2 61.11,17.77 | 59.05,24.55 59.06,24.56 | D2.A 59.06,24.59 59.06,24.56 | 59.06,24.56 59.06,23.25 60.21,22.1 C5.P$1 61.12,19.97 61.12,17.92 C6.P$1 | 46.35,5.36 46.35,4.45 | 21.27,24.77 23.55,24.77 24.18,25.4 v24.18,28.57 24.18,29.99 23.27,30.89 | 21.27,24.77 21.2,24.77 | v41.32,24.08 41.32,25.8 C22.P$1 | 23.27,30.89 22.26,31.91 R8.P$2 | R14.P$2 23.5,30.89 23.27,30.89
  Bottom 0.127: 35.63,24.68 v35.72,24.68
  Bottom 0.254: v43.18,10.79 43.18,8 v40.77,5.58
  Bottom 0.406: v34.87,23.92 35.63,24.68 | v23.5,20.78 v23.5,17.32 | v42.38,23.02 v41.32,24.08 40.23,22.98 37.41,22.98 v35.72,24.68 | J6.2 20.32,37.47 15.24,32.38 15.24,29.21 16.8,27.66 23.26,27.66 v24.18,28.57
3V3_PG  (via drill 0.3)
  Top 0.127: v18.89,31.05 18.82,30.98 U3.12 | v23.57,33.55 24.47,33.55 | U1.35 36.29,24.7 36.29,25.58 36.66,25.95 36.66,26.39 33.9,29.15 33.9,34.17 v33.77,34.3
  Top 0.254: 24.47,33.55 R14.P$1
  Bottom 0.127: v18.89,31.05 21.07,31.05 v23.57,33.55 24.21,34.19 33.62,34.19 33.75,34.32 v33.77,34.3
!CRESET  (via drill 0.3)
  Top 0.127: v41.94,13.36 41.94,13.91 41.88,13.98 41.88,14.17 U1.7 | R6.P$2 58.03,14.69 v58.01,14.69 57.8,14.88 57.8,15.57 U2.10
  Bottom 0.127: v58.01,14.69 57.22,14.69 56.05,13.52 46.38,13.52 45.01,14.88 43.91,14.88 42.39,13.36 v41.94,13.36
!MCU_RESET  (via drill 0.3)
  Top 0.127: v43.27,21.77 42.56,21.07 U1.21 | R1.P$1 30.31,8.97 TC1.10 | v20.32,7.62 18.23,7.62 SW1.1
  Bottom 0.127: v43.27,21.77 43.14,21.77 36.4,15.03 31.54,15.03 30.48,13.97 30.48,9.11 TC1.10 28.99,7.62 v20.32,7.62
  other vias: 30.34,8.97
CDONE  (via drill 0.3)
  Top 0.127: R5.P$1 59.33,15.96 v59.3,15.96 59.14,16.12 57.97,16.12 U2.11 | U1.17 44.56,19.06 44.56,18.56 v45.13,17.99
  Bottom 0.127: v45.13,17.99 47.61,15.51 54.92,15.51 57.68,18.26 59.69,18.26 60.22,17.73 60.22,16.93 59.31,16.02 | 59.31,16.02 59.31,16 | v59.3,15.96 59.31,15.98 59.31,16.02
CLK  (via drill 0.3)
  Top 0.127: U1.18 43.63,20 44.21,20.58 45.24,20.58 45.38,20.45 v46.33,20.45 | U2.19 v58.97,20.96
  Bottom 0.127: v46.33,20.45 46.48,20.6 58.61,20.6 v58.97,20.96
DN
  Top 0.127: U1.47 32.02,20.49 31.68,20.49 31.29,20.11 17.9,20.11 17.15,19.35 R19.P$2
DP
  Top 0.127: U1.48 32.14,19.67 19.2,19.67 R18.P$2
GND  (via drill 0.3)
  Top 0.127: 17.83,28.55 U3.21 | 17.33,28.05 U3.21 | 18.83,28.05 U3.21 | 18.33,28.55 U3.21 | 56.05,19.45 U2.33 | 54.98,19.1 U2.33 | U2.33 55.93,19.1 v55.24,18.41
  Top 0.254: U3.19 17.83,28.55 | U3.2 17.33,28.05 | U3.5 18.83,28.05 | U3.8 18.33,28.55 | C22.P$2 42.7,26.75 X1.2 | U2.21 56.05,19.45 | U2.3 54.98,19.1 | U1.36 37.47,22.83 v37.47,22.23
  other vias: 60.33,12.7 62.23,12.7 64.14,12.7 64.14,10.79 62.23,10.79 60.33,10.79 56.52,8.89 60.33,8.89 62.23,8.89 64.14,8.89 64.14,6.99 62.23,6.99 60.33,6.99 56.52,6.99 54.61,6.99 54.61,5.08 56.52,5.08 62.23,5.08 64.14,5.08 56.52,24.13 62.23,24.13 64.14,24.13 64.14,22.23 62.23,20.32 64.14,20.32 64.14,18.41 62.23,18.41 64.14,16.51 64.14,14.61 62.23,14.61 54.61,35.56 62.23,35.56 64.14,35.56 64.14,33.66 62.23,33.66 60.33,33.66 56.52,33.66 54.61,33.66 54.61,31.75 56.52,31.75 60.33,31.75 62.23,31.75 64.14,31.75 64.14,29.84 62.23,29.84 60.33,29.84 56.52,29.84 54.61,29.84 54.61,27.94 56.52,27.94 60.33,27.94 62.23,27.94 64.14,27.94 64.14,26.04 62.23,26.04 54.61,26.04 52.7,35.56 50.8,35.56 46.99,35.56 45.09,35.56 43.18,35.56 43.18,33.66 45.09,33.66 46.99,33.66 50.8,33.66 52.7,33.66 52.7,31.75 50.8,31.75 46.99,31.75 45.09,31.75 43.18,31.75 43.18,29.84 45.09,29.84 46.99,29.84 50.8,29.84 52.7,29.84 52.7,27.94 50.8,27.94 46.99,27.94 45.09,27.94 46.99,26.04 50.8,26.04 52.7,26.04 52.7,24.13 50.8,24.13 46.99,24.13 46.99,22.23 46.99,18.41 48.9,18.41 50.8,18.41 48.9,16.51 52.7,12.7 48.9,12.7 46.99,12.7 45.09,12.7 45.09,10.79 46.99,10.79 48.9,10.79 52.7,10.79 52.7,8.89 48.9,8.89 46.99,8.89 48.9,6.99 52.7,5.08 48.91,5.17 41.27,35.56 39.37,35.56 33.66,35.56 31.75,35.56 39.37,33.66 41.27,33.66 41.27,31.75 31.75,31.75 31.75,29.84 41.27,29.84 33.66,27.94 31.75,27.94 39.37,22.23 39.37,20.32 37.47,20.32 35.56,20.32 35.56,18.41 37.47,18.41 41.27,18.41 39.37,16.51 37.47,10.79 39.37,10.79 29.84,35.56 26.04,35.56 24.13,35.56 22.23,35.56 29.84,31.75 29.84,29.84 29.84,27.94 26.04,27.94 26.04,26.04 27.94,24.13 26.04,24.13 27.94,22.23 20.32,18.41 22.23,18.41 24.15,18.41 26.04,18.41 22.23,16.51 20.32,16.51 20.32,14.61 22.23,14.61 27.94,15.88 22.23,12.7 20.32,12.7 20.32,10.79 22.23,10.79 26.04,10.79 27.94,8.89 26.04,8.89 22.23,8.89 20.32,8.89 29.84,6.99 24.13,5.08 22.23,5.08 14.61,35.56 12.7,35.56 10.79,35.56 8.89,35.56 8.89,33.66 10.79,33.66 12.7,33.66 12.7,31.75 10.79,31.75 8.89,31.75 8.89,29.84 10.79,29.84 8.89,27.94 12.7,24.13 10.79,24.13 8.89,24.13 8.89,22.23 10.79,22.23 12.7,22.23 16.54,20.32 12.7,20.32 10.79,20.32 8.92,18.22 18.41,16.51 16.51,16.51 12.7,16.51 10.79,16.51 8.89,16.51 8.89,14.61 10.79,14.61 12.7,14.61 18.41,14.61 14.61,12.7 12.7,12.7 10.79,12.7 8.89,12.7 8.89,10.79 14.61,10.79 16.51,8.89 14.61,8.89 12.7,8.89 10.79,8.89 8.89,8.89 8.89,6.99 14.61,6.99 18.41,5.08 16.51,5.08 14.61,5.08 12.7,5.08 10.79,5.08 8.89,5.08 6.99,35.56 5.08,35.56 3.17,35.56 1.27,35.56 1.27,33.66 3.17,33.66 5.08,33.66 6.99,33.66 6.99,31.75 5.08,31.75 3.17,31.75 1.27,31.75 1.27,29.84 3.17,29.84 5.08,29.84 6.99,29.84 6.99,27.94 5.08,27.94 3.17,27.94 1.27,27.94 1.27,26.04 3.17,26.04 5.08,24.77 1.27,22.86 3.17,22.86 3.17,20.95 1.27,20.95 1.27,19.05 3.17,19.05 3.17,17.14 1.27,17.14 6.99,12.7 1.27,12.7 1.27,10.79 6.99,10.79 6.99,8.89 5.08,8.89 3.17,8.89 1.27,8.89 1.27,6.99 3.17,6.99 5.08,6.99 6.99,6.99 6.99,5.08 5.08,5.08 3.17,5.08 1.27,5.08 24.22,16.51 55.24,19.68 56.52,19.68 56.52,18.41 39.69,30.43 17.78,29.21 18.41,28.57 22.86,29.84 13.34,29.21 33.02,10.79 33.66,6.99 39.37,4.45 37.47,4.45 35.56,4.45 33.66,4.45 31.75,4.45 29.84,4.45 27.94,4.45 26.04,4.45 29.44,11.63 29.42,9.87 18.12,23.77
  pour Bottom: 0,0 0,40.01 65.41,40.01 65.41,0
  pour Top: 0,0 0,40.01 65.41,40.01 65.41,0
GPRST  (via drill 0.3)
  Top 0.127: U1.19 43.85,20.95 v45.72,20.95 | v58.42,21.48 58.42,21.12 U2.20
  Bottom 0.127: v45.72,20.95 57.9,20.95 v58.42,21.48
IOL4A  (via drill 0.3)
  Top 0.127: U2.5 54.27,16.97 54.27,12.25 v55.19,11.34
  Bottom 0.127: v55.19,11.34 57.93,8.59 57.93,3.96 J4.4
IOL4BG7  (via drill 0.3)
  Top 0.127: U2.6 54.88,16.84 54.66,16.63 54.66,12.55 v55.15,12.06
  Bottom 0.127: v55.15,12.06 58.42,8.8 J4.3
IOL5AG6  (via drill 0.3)
  Top 0.127: U2.8 55.38,15.97 55.38,13.32 v55.91,12.8
  Bottom 0.127: v55.91,12.8 59.5,9.21 59.5,5.91 J4.1
IOL5B  (via drill 0.3)
  Top 0.127: U2.7 55.23,16.49 55.02,16.27 55.02,12.93 v55.88,12.06
  Bottom 0.127: v55.88,12.06 58.94,9.01 58.94,3.92 J4.2
IOL_2A  (via drill 0.3)
  Top 0.127: U2.2 50.66,15.48 50.66,12.84 v50.8,12.7
  Bottom 0.127: J4.5 52.94,1.91 50.8,4.04 v50.8,12.7
IOL_2B  (via drill 0.3)
  Top 0.127: U2.1 50.27,15.8 v50.27,12.21
  Bottom 0.127: v50.27,12.21 50.27,3.73 50.8,3.19 J4.6
IOR34  (via drill 0.3)
  Top 0.127: U2.18 58.63,19.95 58.84,20.17 59.28,20.17 v59.52,20.4
  Bottom 0.127: v59.52,20.4 59.53,20.42 59.53,34.13 J2.1
IOR38  (via drill 0.3)
  Top 0.127: U2.22 57.49,21.61 57.81,21.61 58.16,21.96 v58.16,22.5
  Bottom 0.127: v58.16,22.5 58.98,23.32 58.98,36.12 J2.2
IOR39  (via drill 0.3)
  Top 0.127: v57.52,22.12 57.3,22.12 U2.23
  Bottom 0.127: J2.3 58.45,38.07 58.45,23.62 57.74,22.91 57.52,22.69 v57.52,22.12
IOT45  (via drill 0.3)
  Top 0.127: U2.26 54.7,22.21 v54.62,22.21
  Bottom 0.127: v54.62,22.21 v54.63,22.21 56.32,22.21 57.91,23.8 57.91,36.08 J2.4
IOT47  (via drill 0.3)
  Top 0.127: U2.27 54.48,21.72 54.42,21.72 54.04,22.1 v54.04,22.71
  Bottom 0.127: v54.04,22.71 56.02,22.71 57.35,24.04 57.35,34.09 J2.5
IOT49G0  (via drill 0.3)
  Top 0.127: U2.29 53.84,20.95 51.47,20.95 50.19,22.23 v50.19,22.41
  Bottom 0.127: v50.19,22.41 49.93,22.67 49.93,37.23 J2.6
IOT50G1  (via drill 0.3)
  Top 0.127: U2.30 53.38,20.7 50.99,20.7 49.44,22.26 v49.44,22.4
  Bottom 0.127: v49.44,22.4 49.44,36.92 J2.7
IOT52  (via drill 0.3)
  Top 0.127: U2.32 53.11,19.23 49.85,15.97 49.85,12.86 v49.73,12.74
  Bottom 0.127: v49.73,12.74 49.73,3.54 48.26,2.07 J4.7
IOT53  (via drill 0.3)
  Top 0.127: U2.31 52.98,20.4 50.57,20.4 48.69,22.28 v48.69,22.41
  Bottom 0.127: v48.69,22.41 48.96,22.68 48.96,34.86 J2.8
LED_CLK
  Top 0.152: U1.30 39.73,24.61 39.73,25.87 39.09,26.51 39.09,28.29 38.68,28.71 36.61,28.71 35.97,29.35 35.97,30.7 36.49,31.22 37.02,31.22 D1.4
LED_MOSI
  Top 0.152: U1.28 40.74,24.2 40.74,25.45 39.5,26.7 39.5,28.43 40.22,29.14 40.22,30.67 39.63,31.25 D1.3
MAIN_HFXTAL_N
  Top 0.127: X1.1 43.34,24.68 U1.25
MAIN_HFXTAL_P
  Top 0.127: X1.3 43.84,25.89 U1.26
MAIN_LFXTAL_N
  Top 0.127: X2.2 45.69,16.73 U1.16
MAIN_LFXTAL_P
  Top 0.127: X2.1 45.32,16.39 U1.15
MISO  (via drill 0.3)
  Top 0.127: U1.10 41.93,16.33 42.41,15.85 v44.03,15.85 | U2.12 58.17,16.62 v58.17,16.61
  Bottom 0.127: v58.17,16.61 57.96,16.61 55.63,14.29 46.89,14.29 45.33,15.85 v44.03,15.85
MOSI  (via drill 0.3)
  Top 0.127: U1.9 42.04,15.43 43.36,15.43 v43.49,15.3 | v58.9,16.61 v58.89,16.61 U2.13
  Bottom 0.127: v58.9,16.61 58.31,16.03 58.01,16.03 55.87,13.9 46.64,13.9 45.24,15.3 v43.49,15.3
MPU_PWR
  Top 0.254: U3.18 15.15,29.05 R10.P$1
N$1
  Top 0.127: D2.C 58.24,23.22
  Top 0.254: U2.24 D2.C | C7.P$1 59.01,22.45 58.24,23.22
N$32
  Top 0.254: U3.9 21.01,29.05 R7.P$1
N$33
  Top 0.254: L1.2 18.33,26.03 U3.4
N$34
  Top 0.254: U3.13 18.33,31.29 C10.P$1
N$35
  Top 0.127: 20.59,31.92 R8.P$1
  Top 0.254: U3.11 19.33,30.64 R8.P$1 | R9.P$2 20.59,31.92
N$36
  Top 0.254: L2.2 17.83,26.03 U3.3
N$37
  Top 0.254: U3.14 17.83,31.29 C13.P$1
N$38
  Top 0.127: 15.57,31.92 R12.P$2
  Top 0.254: U3.16 16.83,30.66 R12.P$2 | R13.P$1 15.57,31.92
N$39
  Top 0.127: U1.46
  Top 0.254: U1.46 32.03,21.2 C17.P$1
N$40  (1 unrouted)
  Top 0.127: 5.3,26.16 F1.2
  Top 0.254: 5.77,17.51 6.52,17.51 6.75,17.29 USB1.B4/A9 | 5.08,22.54 5.09,22.55 5.74,21.91 6.6,21.91 6.83,22.14 7.22,22.14
  Top 0.406: 5.77,17.51 5.08,18.2 5.08,22.54 5.08,22.55 4.38,23.26 4.38,25.23 5.3,26.16
N$41  (via drill 0.3)
  Top 0.127: R15.P$2 5.61,11.79 v4.7,12.7
  Top 0.152: v6.31,20.41 6.31,20.91 6.83,21.43 USB1.B8
  Bottom 0.127: v4.7,12.7 4.53,12.87 4.53,17.21 6.31,19 v6.31,20.41
N$42  (via drill 0.3)
  Top 0.127: v3.97,12.67 R16.P$2
  Top 0.152: v5.82,19.32 6.7,18.43 USB1.A8
  Bottom 0.127: v5.82,19.32 5.82,18.98 4.17,17.33 4.17,12.87 v3.97,12.67
N$43
  Top 0.127: 34.91,24.67 L3.1
  Top 0.254: U1.37 34.91,24.67
N$45
  Top 0.254: U1.40 34.53,22.93 32.84,22.93 C23.P$1
N$48
  Top 0.127: 32.54,25.91 L3.2 32.55,25.93
  Top 0.254: C18.P$1 32.54,25.91 | U1.39 34.82,23.35 33.69,23.35 32.55,24.49 32.55,25.93
PD3  (via drill 0.3)
  Top 0.127: U1.31 39.37,24.96 39.37,25.67 38.59,26.45 v38.59,27.66
  Bottom 0.127: v38.59,27.66 38.31,27.66 37.81,28.16 37.81,35.26 40.45,37.91 J3.2
PD4
  Top 0.127: U1.32 37.71,25.91 37.71,27.03 35.34,29.4 35.34,35.34 J3.3 38.1,37.91
PD5
  Top 0.127: J3.4 34.88,37.42 34.88,29.24 37.34,26.79 37.34,25.07 U1.33
PD6
  Top 0.127: U1.34 37.09,24.6 36.67,25.03 36.67,25.39 37.01,25.73 37.01,26.59 34.38,29.21 34.38,36.74 J3.5
PE4
  Top 0.127: J3.6 30.48,37.71 28.72,35.95 28.72,26.04 32.18,22.58 34.17,22.58 U1.41
PE5
  Top 0.127: U1.42 33.78,22.27 31.89,22.27 28.11,26.05 28.11,37.93 J3.7
PE6  (via drill 0.3)
  Top 0.127: U1.43 33.38,21.96 31.92,21.96 v31.71,21.75 | v31.14,18.44 29.23,18.44 24.59,13.8 24.59,8.38 v26.47,6.5
  Bottom 0.127: v31.71,21.75 31.14,21.18 v31.14,18.44 | v26.47,6.5 25.86,7.11 25.39,7.11 25.03,6.75 25.03,6.28 25.23,6.08 25.23,2.08 J5.8
PE7  (via drill 0.3)
  Top 0.127: U1.44 33.34,21.07 32.99,21.41 32.6,21.41 v32.54,21.47 | v31.75,19.05 29.21,19.05 24.1,13.94 24.1,8.03 v25.62,6.51
  Bottom 0.127: v32.54,21.47 31.75,20.68 v31.75,19.05 | J5.7 27.81,1.91 25.7,4.01 25.7,6.43 v25.62,6.51
PE8  (via drill 0.3)
  Top 0.127: U1.56 33.47,14.8 v33.47,14.53 v33.47,14.52
  Bottom 0.127: v33.47,14.52 33.47,10.61 32.57,9.7 32.57,3.99 J5.6
PE9  (via drill 0.3)
  Top 0.127: U1.57 34.37,15.01 34.35,15.01 34.01,14.68 v34.01,14.03
  Bottom 0.127: v34.01,14.03 34.01,10.52 32.99,9.5 32.99,1.94 J5.5
PE10  (via drill 0.3)
  Top 0.127: v34.55,14.52 v34.55,14.53 35.29,15.27 U1.58
  Bottom 0.127: v34.55,14.52 34.55,10.47 33.42,9.34 33.42,4 35.52,1.91 J5.4
PE11  (via drill 0.3)
  Top 0.127: v33.94,8.94 33.94,12.74 34.27,13.07 34.27,13.49 U1.59
  Bottom 0.127: v33.94,8.94 33.94,8.88 33.86,8.8 33.86,8.18 38.46,3.58 38.46,2.27 J5.3
PE12  (via drill 0.3)
  Top 0.127: U1.60 34.8,13.32 34.8,13.09 34.43,12.72 34.43,8.35 v34.42,8.34
  Bottom 0.127: J5.2 40.64,2.12 v34.42,8.34
PE13  (via drill 0.3)
  Top 0.127: U1.61 34.92,12.73 v34.92,8.89
  Bottom 0.127: v34.92,8.89 34.92,8.5 39.4,4.03 41.05,4.03 J5.1
PF12  (via drill 0.3)
  Top 0.127: U1.53 32.92,16.39 v32.92,16.25 | v26.67,25.4 26.7,25.4 27.5,26.2 27.5,35.99 J3.8
  Bottom 0.127: v32.92,16.25 32.92,16.32 32.33,16.91 31.89,16.91 26.67,22.14 v26.67,25.4
QSPI_CLK
  Top 0.127: U1.62 35.56,12.66 35.56,8.89 36.33,8.12 U6.6
QSPI_CS0  (via drill 0.3)
  Top 0.127: v40.01,8.89 40.01,8.26 42.67,5.58 U6.1 44.99,5.58 46.54,7.13 R17.P$1 | U1.1 40.01,11.8 v40.01,11.43
  Bottom 0.127: v40.01,8.89 v40.01,11.43
QSPI_D0
  Top 0.127: U6.5 39.24,9.39 40.64,10.79 40.64,12.58 U1.3
QSPI_D1
  Top 0.127: U6.2 42.67,6.86 41.27,8.26 41.27,12.65 U1.4
QSPI_D2
  Top 0.127: U6.3 42.67,8.12 41.91,8.89 41.91,12.7 40.08,14.54 U1.5
QSPI_D3  (via drill 0.3)
  Top 0.127: U6.7 39.36,6.86 v39.99,7.48 | v41.3,14 40.43,14.88 U1.6
  Bottom 0.127: v39.99,7.48 40.64,8.13 40.64,13.34 v41.3,14
SCK  (via drill 0.3)
  Top 0.127: v44.54,16.39 43.87,16.39 43.67,16.18 42.69,16.18 U1.11 | v59.62,17.43 59.49,17.43 59.38,17.53 59.38,17.54 U2.15
  Bottom 0.127: v44.54,16.39 43.67,16.39 43.42,16.63 43.42,17.19 43.66,17.43 45.08,17.43 47.36,15.14 55.26,15.14 57.97,17.86 59.19,17.86 v59.62,17.43
SS  (via drill 0.3)
  Top 0.127: U2.14 58.87,17.34 v58.89,17.34 | v44.01,16.88 43.69,16.56 43.03,16.56 U1.12
  Bottom 0.127: v58.89,17.34 58.85,17.37 58.1,17.37 55.44,14.71 47.16,14.71 44.88,16.99 44.12,16.99 v44.01,16.88
SWCLK
  Top 0.127: U1.49 28.55,14.84 TC1.4
SWDIO
  Top 0.127: U1.50 29.21,14.8 29.21,13.34 30.34,12.2 TC1.2
SWO  (via drill 0.3)
  Top 0.127: U1.51 29.84,14.72 v29.84,14.61
  Bottom 0.127: v29.84,14.61 27.8,12.56 TC1.6
  other vias: 26.75,12.56
USBDN
  Top 0.127: D3.4 11.08,19.3 12.11,18.27 14.06,18.27 14.98,19.19 R19.P$1
  Top 0.152: USB1.A7 10.26,19.43 D3.4 9.26,20.43 USB1.B7
USBDP
  Top 0.127: 11.17,18.39 12.06,17.5 D3.2 12.81,17.5 13.25,17.94 14.05,17.94 14.39,17.6 R18.P$1
  Top 0.152: USB1.A6 6.74,19.93 6.48,19.68 6.48,19.14 6.69,18.93 USB1.B6 9.31,18.93 9.85,18.39 11.17,18.39
VUSB  (via drill 0.3)
  Top 0.127: C8.P$1 23.15,27.84 | 12.98,25.87 C15.P$1 | 21.58,26.94 v21.61,26.91 | 14.56,27.96 R10.P$2 | 7.11,26.14 F1.1 | v35.95,32.6 35.97,32.59
  Top 0.254: C12.P$1 31.19,15.32 32.06,16.19 v32.06,16.24 U1.52 | U3.6 U3.7 21.51,28.05 R7.P$2 | U3.1 U3.20 14.65,28.05 R10.P$2 | D1.5 37.45,30.45 37.91,30.91 37.91,31.76 C25.P$1 35.97,32.59
  Top 0.406: 23.15,27.84 21.72,27.84 R7.P$2 21.58,26.94 | C9.P$1 C8.P$1 | R10.P$2 14.44,27.84 13.16,27.84 C16.P$1 12.98,25.87 | v14.56,26.9 14.56,27.96 | v8.57,26.14 7.11,26.14 | D3.3 13.08,19.3 v13.34,19.05
  Bottom 0.127: v14.57,26.91 v14.56,26.9
  Bottom 0.406: v21.61,26.91 v14.57,26.91 | v14.56,26.9 v14.55,26.89 9.32,26.89 v8.57,26.14 | v21.61,26.91 23.63,26.91 29.32,32.6 v35.95,32.6 | v32.06,16.24 31.78,16.24 21.61,26.41 v21.61,26.91 | v14.56,26.9 14.56,20.27 v13.34,19.05 13.34,16.51 17.78,12.06 J7.3 | v14.56,26.9 14.56,32.98 17.78,36.2 J6.3

### Text on the board
tPlace: Icy-Gecko / HV1.0 / #2519 | Designed in Portugal
bPlace: GND | VUSB | 3V3 | 1V2 | PF12 | PE5 | PE4 | PD6 | PD5 | PD4 | PD4 | GND | IOT53 | IOT50G1 | IOT49G0 | IOT47 | IOT45 | IOR39 | IOR38 | IOR34 | MCU: EFM32GG12B810 / FPGA: ICE40LP384 | GND | VUSB | 3V3 | 1V2 | PE6 | PE7 | PE8 | PE9 | PE10 | PE11 | PE12 | PE13 | GND | IOT52 | IOL2B | IOL2A | IOL4A | IOL4BG7 | IOL5B | IOL5AG6